# Altium project Sensor de Nivel.PrjPcb
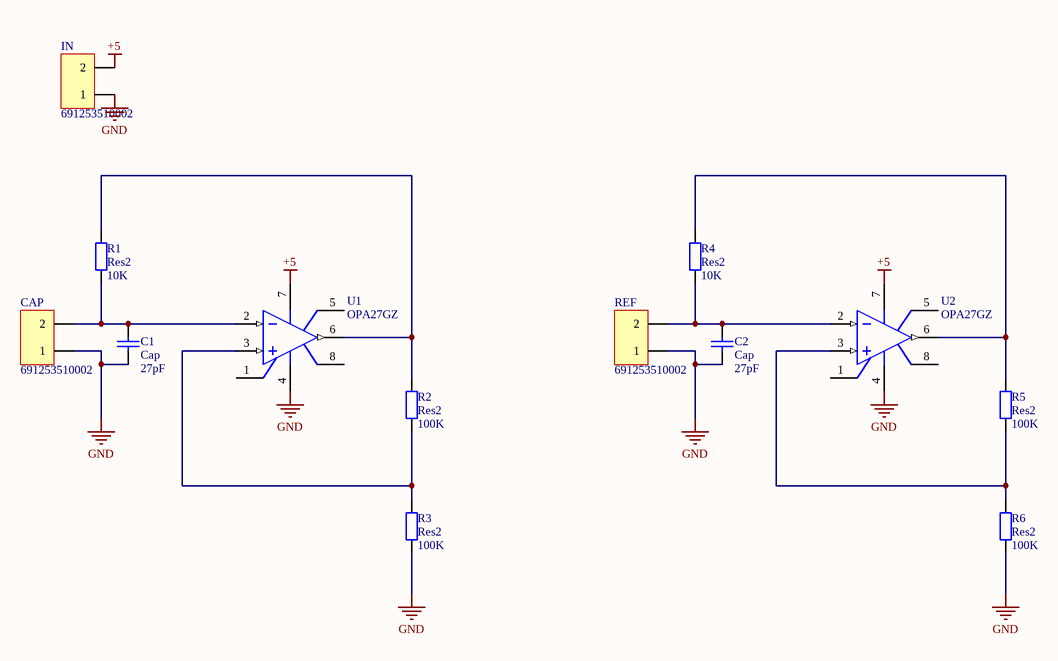
[diagram p0: Condicionamento.SchDoc]
1 sheet, 13 parts. Net scope: global (net labels, ports and power ports of the same name join across sheets).
Board file: Sensor.PcbDoc

## Sheet Condicionamento.SchDoc
size A

### Parts
C1  Cap  value 27pF  [RAD-0.3]
C2  Cap  value 27pF  [RAD-0.3]
CAP  691253510002  [691253510002]
IN  691253510002  [691253510002]
R1  Res2  value 10K  [AXIAL-0.4]
R2  Res2  value 100K  [AXIAL-0.4]
R3  Res2  value 100K  [AXIAL-0.4]
R4  Res2  value 10K  [AXIAL-0.4]
R5  Res2  value 100K  [AXIAL-0.4]
R6  Res2  value 100K  [AXIAL-0.4]
REF  691253510002  [691253510002]
U1  OPA27GZ  [ZZ161]
U2  OPA27GZ  [ZZ161]

### Nets
+5: IN.2 U1.7(V+) U2.7(V+)
GND: C1.1 C2.1 CAP.1 IN.1 R3.1 R6.1 REF.1 U1.4(V-) U2.4(V-)
NetC1_2: C1.2 CAP.2 R1.1 U1.2(IN-)
NetC2_2: C2.2 R4.1 REF.2 U2.2(IN-)
NetR1_2: R1.2 R2.2 U1.6(OUT)
NetR2_1: R2.1 R3.2 U1.3(IN+)
NetR4_2: R4.2 R5.2 U2.6(OUT)
NetR5_1: R5.1 R6.2 U2.3(IN+)

Not connected (* = marked no-connect by the designer): U1 1(OS_TRIM) 5(NC) 8(OS_TRIM); U2 1(OS_TRIM) 5(NC) 8(OS_TRIM)

### Library data of the parts
C1 C2 = Cap: Capacitor; Published: 8-Jun-2000; LatestRevisionDate: 17-Jul-2002; LatestRevisionNote: Re-released for DXP Platform.; PackageReference: RAD-0.3; Publisher: Altium Limited; PackageDescription: Radial Cap, Thru-Hole; 2 Leads; 0.3 in Pin Spacing
CAP IN REF = 691253510002: Horizontal Cable Entry with Rising Cage Clamp, Serie 2535 - 5.08mm; Manufacturer: Wurth Elektronik; ComponentLink1 Description: Manufacturer; ComponentLink2 Description: Datasheet; NoPins: 2; ComponentLink1 URL: http://www.we-online.com; ComponentLink2 URL: http://katalog.we-online.de/em/datasheet/6912535100xx.pdf; Created By: Baojun Chen; Created Date: 27.Aug.2015; PartNo: 691253510002
R1-R6 = Res2: Resistor; Published: 8-Jun-2000; LatestRevisionDate: 17-Jul-2002; LatestRevisionNote: Re-released for DXP Platform.; PackageReference: AXIAL-0.4; Publisher: Altium Limited; PackageDescription: Axial Device, Thru-Hole; 2 Leads; 0.4 in Pin Spacing
U1 U2 = OPA27GZ: Ultra-Low-Noise Precision Operational Amplifiers; Note: Pin 5 is No internal Connection (NC) pin.; Published: 8-Jun-2000; LatestRevisionDate: 06-Jun-2005; LatestRevisionNote: Stylized 3D Model Added.; DatasheetVersion: 1996~1997; PackageVersion: revC; PackageReference: ZZ161; Publisher: Altium Limited; PackageDescription: CerDIP; 8 Leads; Row Spacing 7.62 mm; Pitch 2.54 mm; ComponentLink1Description: Manufacturer Link; ComponentLink1URL: http://www.ti.com/; ComponentLink2Description: Datasheet; ComponentLink2URL: http://focus.ti.com/docs/prod/folders/print/opa27.html